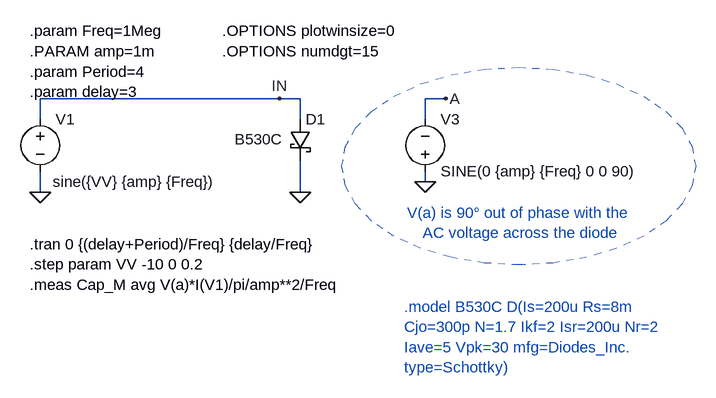
[diagram p0: schematic Fig_11-41_Capometer-Mike_B530C.asc]
Fig_11-41_Capometer-Mike_B530C.asc, the LTspice schematic file:
Version 4
SHEET 1 1796 892
WIRE 448 144 80 144
WIRE 480 144 448 144
WIRE 704 144 672 144
WIRE 80 176 80 144
WIRE 480 176 480 144
WIRE 672 176 672 144
WIRE 672 272 672 256
WIRE 80 288 80 256
WIRE 480 288 480 240
FLAG 80 288 0
FLAG 480 288 0
FLAG 672 272 0
FLAG 704 144 A
FLAG 448 144 IN
SYMBOL voltage 80 160 R0
WINDOW 3 19 112 Left 2
SYMATTR Value sine({VV} {amp} {Freq})
SYMATTR InstName V1
SYMBOL voltage 672 272 M180
WINDOW 0 24 96 Left 2
WINDOW 3 24 16 Left 2
WINDOW 123 24 -26 Left 2
WINDOW 39 24 -5 Left 2
SYMATTR InstName V3
SYMATTR Value SINE(0 {amp} {Freq} 0 0 90)
SYMBOL schottky 464 176 R0
WINDOW 3 -85 31 Left 2
SYMATTR Value B530C
SYMATTR InstName D1
SYMATTR Description Diode
SYMATTR Type diode
TEXT 64 368 Left 2 !.tran 0 {(delay+Period)/Freq} {delay/Freq}\n.step param VV -10 0 0.2\n.meas Cap_M avg V(a)*I(V1)/pi/amp**2/Freq
TEXT 816 304 Top 2 ;V(a) is 90° out of phase with the\n AC voltage across the diode
TEXT 64 40 Left 2 !.param Freq=1Meg\n.PARAM amp=1m\n.param Period=4\n.param delay=3
TEXT 360 40 Left 2 !.OPTIONS plotwinsize=0\n.OPTIONS numdgt=15
TEXT 640 464 Left 2 ;.model B530C D(Is=200u Rs=8m \nCjo=300p N=1.7 Ikf=2 Isr=200u Nr=2 \nIave=5 Vpk=30 mfg=Diodes_Inc. \ntype=Schottky)
CIRCLE Normal 1088 400 544 96 1

The netlist it stands for:
* Fig_11-41_Capometer-Mike_B530C.asc
V1 IN 0 sine({VV} {amp} {Freq})
V3 0 A SINE(0 {amp} {Freq} 0 0 90)
D1 IN 0 B530C
.model D D
.lib standard.dio
.tran 0 {(delay+Period)/Freq} {delay/Freq}
.step param VV -10 0 0.2
.meas Cap_M avg V(a)*I(V1)/pi/amp**2/Freq
* V(a) is 90° out of phase with the
*  AC voltage across the diode
.param Freq=1Meg
.PARAM amp=1m
.param Period=4
.param delay=3
.OPTIONS plotwinsize=0
.OPTIONS numdgt=15
* .model B530C D(Is=200u Rs=8m
* Cjo=300p N=1.7 Ikf=2 Isr=200u Nr=2
* Iave=5 Vpk=30 mfg=Diodes_Inc.
* type=Schottky)
.backanno
.end